# EasyEDA schematic SCH_MATESSE daughter Board electronics.json
TITLE: ADC input voltage; REV: 1.0; Date: 2022-03-18; Sheet: 1/1; Drawn By: Albert Risco; Company: NASA GSFC
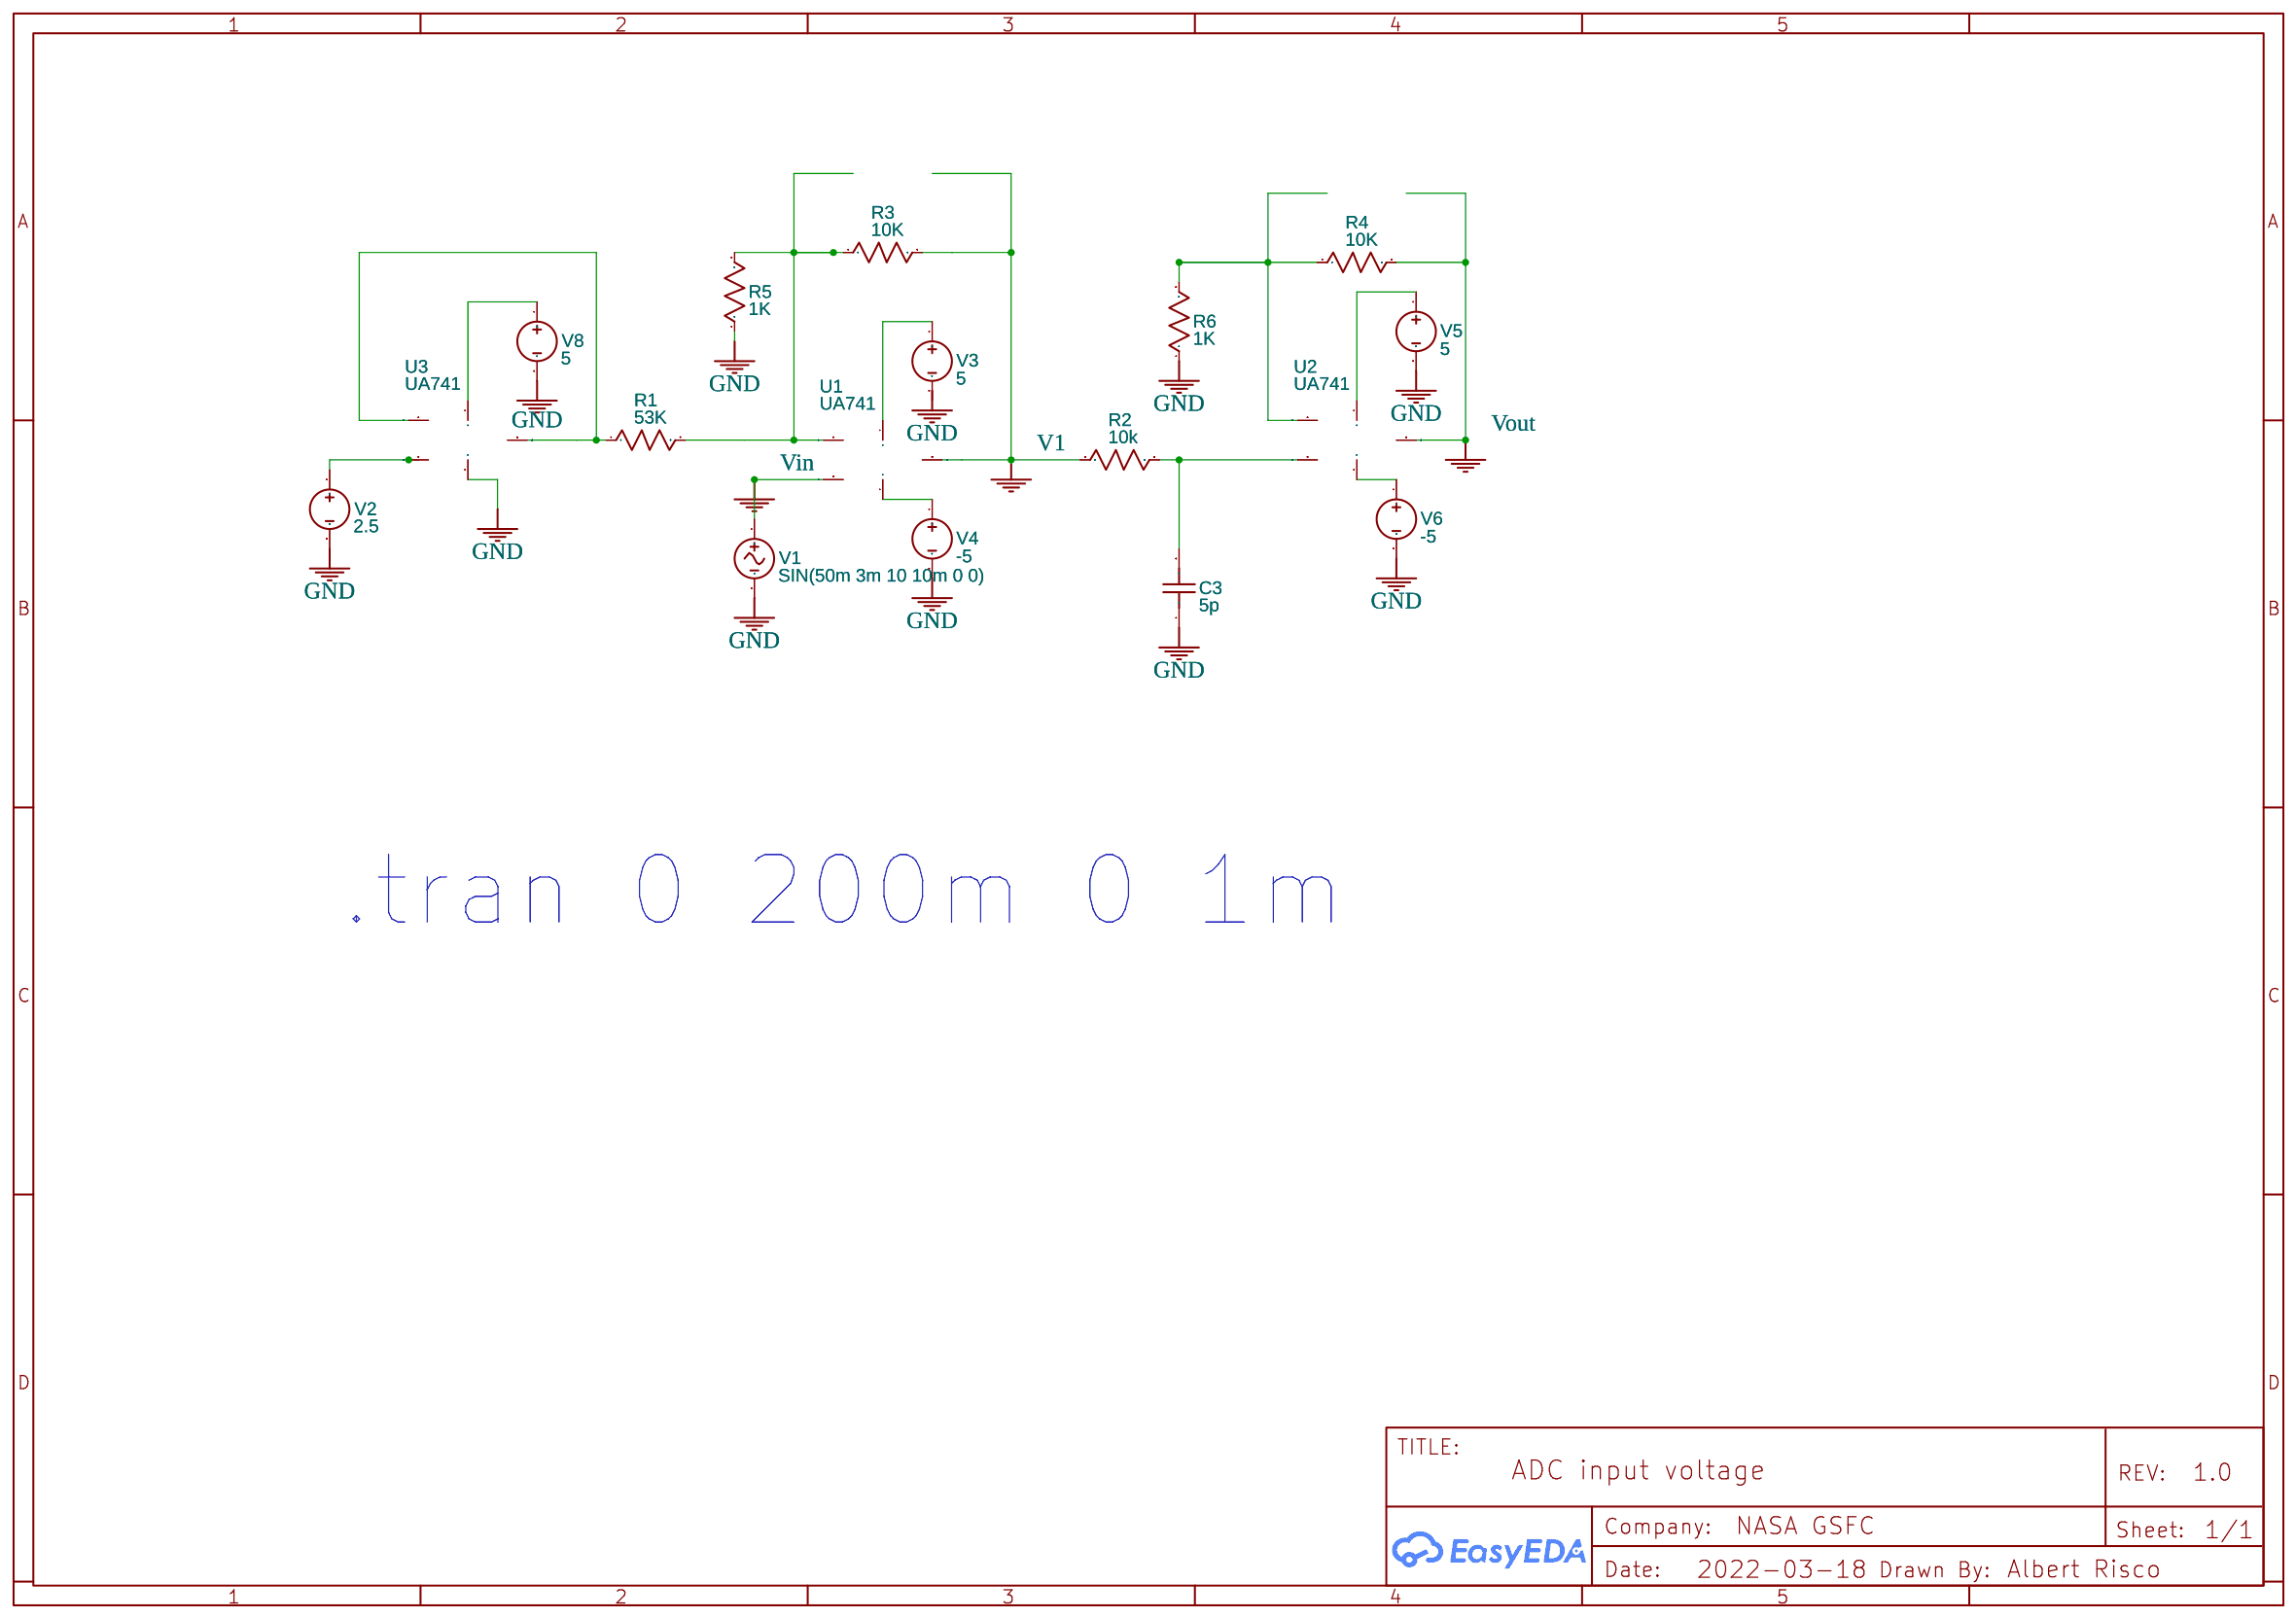
[diagram p0: schematic sheet]

## Parts
C3  5p  [RAD-0.1]
R1  53K  [AXIAL-0.3]
R2  10k  [AXIAL-0.3]
R3  10K  [AXIAL-0.3]
R4  10K  [AXIAL-0.3]
R5  1K  [AXIAL-0.3]
R6  1K  [AXIAL-0.3]
U1  UA741
U2  UA741
U3  UA741
V1  SIN(50m 3m 10 10m 0 0)  [HDR1X2]
V2  2.5  [HDR1X2]
V3  5  [HDR1X2]
V4  -5  [HDR1X2]
V5  5  [HDR1X2]
V6  -5  [HDR1X2]
V8  5  [HDR1X2]

## Library data of the parts
C3 = Capacitor_US: Contributor: EasyEDA; Supplier: YUJING; Capacitance: 1u
R1-R6 = Resistor_US: Resistance: 1k; Contributor: EasyEDA; Supplier: YUJING
U1-U3 = UA741: Contributor: EasyEDA
V1 = VSin: Contributor: EasyEDA; sim: true
V2-V6 V8 = VDC: Contributor: EasyEDA; sim: true

## Nets
GND: C3.1 R5.1 R6.1 U3.4(V-) V1.2 V2.2 V3.2 V4.2 V5.2 V6.2 V8.2
V1: R2.1 R3.2 U1.6(OUT)
Vin: U1.3(IN+) V1.1
Vout: R4.2 U2.6(OUT)
Net-(C3-2): C3.2 R2.2 U2.3(IN+)
Net-(R1-1): R1.1 U3.2(IN-) U3.6(OUT)
Net-(R1-2): R1.2 R3.1 R5.2 U1.2(IN-)
Net-(R4-1): R4.1 R6.2 U2.2(IN-)
Net-(U1-4): U1.4(V-) V4.1
Net-(U1-7): U1.7(V+) V3.1
Net-(U2-4): U2.4(V-) V6.1
Net-(U2-7): U2.7(V+) V5.1
Net-(U3-3): U3.3(IN+) V2.1
Net-(U3-7): U3.7(V+) V8.1

## Notes on the sheet
- .tran 0 200m 0 1m
